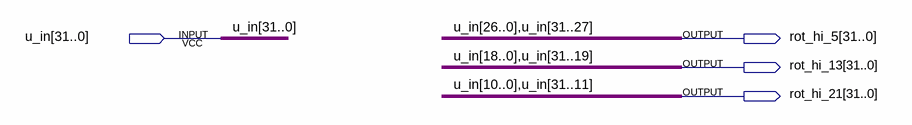
[diagram p0: schematic sheet]
// Quartus schematic RotHi_func.bdf as structural Verilog: 0 symbols, 4 pins
module RotHi_func (
  input  [31:0] u_in,
  output [31:0] rot_hi_5,
  output [31:0] rot_hi_13,
  output [31:0] rot_hi_21
);


  assign rot_hi_5 = {u_in[26:0], u_in[31:27]};
  assign rot_hi_13 = {u_in[18:0], u_in[31:19]};
  assign rot_hi_21 = {u_in[10:0], u_in[31:11]};
endmodule
